# Altium schematic sheet Battery Manager.SchDoc: Battery Manager
size A4; CompanyName: St. Cloud State University; Organization: Senior Design Project; Address1: Prosthetic Hand; Address2: Matthew Varas; Address3: Rachel Mertz; Address4: Donnell Jones; DocumentNumber: 4; Revision: 1.1; SheetNumber: 4; SheetTotal: 6
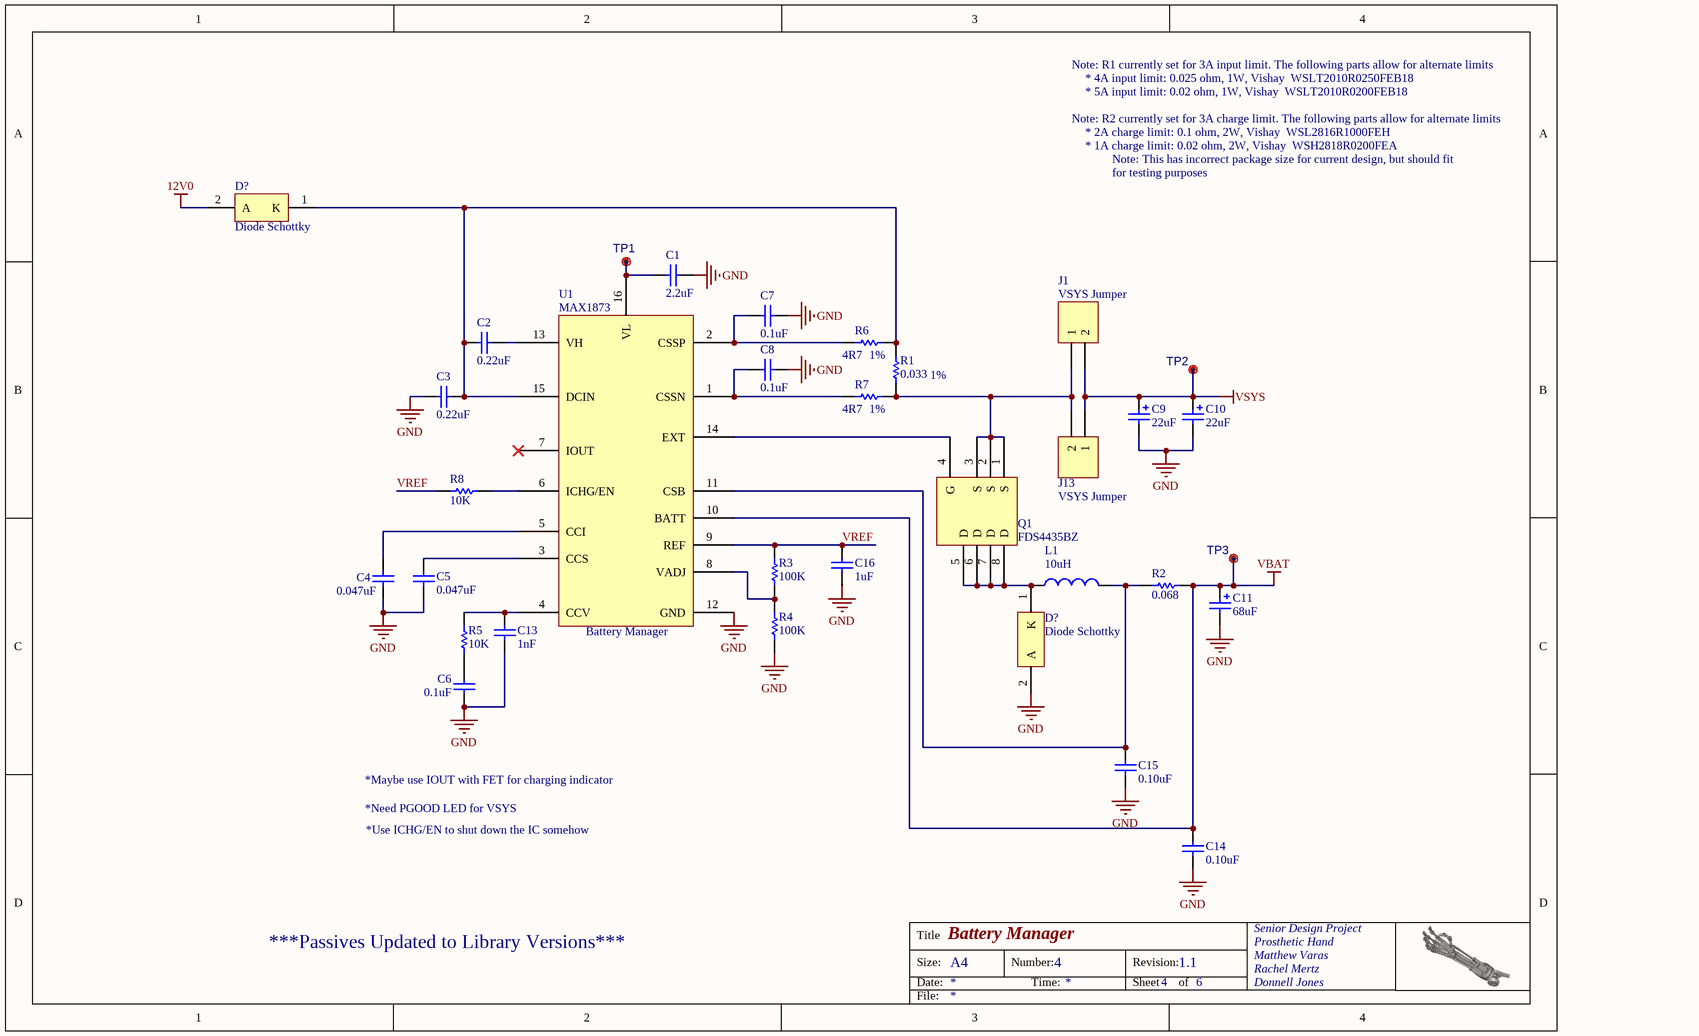
[diagram p0: Battery Manager.SchDoc]

## Parts
(Parts that share a designator on the sheet are numbered #1, #2 ... from top to bottom, then left to right.)
C1  value 2.2uF  [0805 Cap]  (hidden comment: Cap)
C2  value 0.22uF  [0805 Cap]  (hidden comment: Cap)
C3  value 0.22uF  [0805 Cap]  (hidden comment: Cap)
C4  value 0.047uF  [0805 Cap]  (hidden comment: Cap)
C5  value 0.047uF  [0805 Cap]  (hidden comment: Cap)
C6  value 0.1uF  [0805 Cap]  (hidden comment: Cap)
C7  value 0.1uF  Tolerance: 1%  [0805 Cap]  (hidden comment: Cap)
C8  value 0.1uF  [0805 Cap]  (hidden comment: Cap)
C9  22uF  [Cap Tant D]
C10  22uF  [Cap Tant D]
C11  68uF  [Cap Tant E]
C13  value 1nF  [0603 Cap]  (hidden comment: Cap)
C14  value 0.10uF  [0805 Cap]  (hidden comment: Cap)
C15  value 0.10uF  [0805 Cap]  (hidden comment: Cap)
C16  value 1uF  [0805 Cap]  (hidden comment: Cap)
D?#1  Diode Schottky  [ONSC-SMC-2-403-03_V]
D?#2  Diode Schottky  [ONSC-SMC-2-403-03_V]
J1  VSYS Jumper  [HDR1X2]
J13  VSYS Jumper  [HDR1X2]
L1  10uH  [SRR1260 Ind]
Q1  FDS4435BZ  [SOIC-8]
R1  value 0.033  Tolerance: 1%  [2010 Resistor]  (hidden comment: Resistor)
R2  0.068  [WSL2816]
R3  value 100K  [0805 Resistor]  (hidden comment: Resistor)
R4  value 100K  [0805 Resistor]  (hidden comment: Resistor)
R5  value 10K  [0805 Resistor]  (hidden comment: Resistor)
R6  value 4R7  [0603 Resistor]  (hidden comment: Resistor)
R7  value 4R7  Tolerance: 1%  [0603 Resistor]  (hidden comment: Resistor)
R8  value 10K  [0805 Resistor]  (hidden comment: Resistor)
TP1  Test Point  [Testpoint_70]  (value not drawn)
TP2  Test Point  [Testpoint_70]  (value not drawn)
TP3  Test Point  [Testpoint_70]  (value not drawn)
U1  MAX1873  Desc: Battery Manager  [QSOP-16]

## Nets
12V0: D?#1.2(A)
GND: C1.1 C3.2 C4.1 C5.1 C6.2 C7.1 C8.1 C9.2 C10.2 C11.2 C13.1 C14.1 C15.1 C16.1 D?#2.2(A) R4.1 U1.12(GND)
VBAT: C11.1 C14.2 R2.1 TP3.1(M80) U1.10(BATT)
VSYS: C9.1 C10.1 J1.2 J13.1 TP2.1(M80)
VREF: C16.2 R3.2 R8.1 U1.9(REF)
NetC1_2: C1.2 TP1.1(M80) U1.16(VL)
NetC2_1: C2.1 U1.13(VH)
NetC2_2: C2.2 C3.1 D?#1.1(K) R1.2 R6.2 U1.15(DCIN)
NetC4_2: C4.2 U1.5(CCI)
NetC5_2: C5.2 U1.3(CCS)
NetC6_1: C6.1 R5.1
NetC7_2: C7.2 R6.1 U1.2(CSSP)
NetC8_2: C8.2 R7.1 U1.1(CSSN)
NetC13_2: C13.2 R5.2 U1.4(CCV)
NetC15_2: C15.2 L1.2 R2.2 U1.11(CSB)
NetD?#2_1: D?#2.1(K) L1.1 Q1.5(D) Q1.6(D) Q1.7(D) Q1.8(D)
NetJ1_1: J1.1 J13.2 Q1.1(S) Q1.2(S) Q1.3(S) R1.1 R7.2
NetQ1_4: Q1.4(G) U1.14(EXT)
NetR3_1: R3.1 R4.2 U1.8(VADJ)
NetR8_2: R8.2 U1.6(ICHG/EN)

Not connected (* = marked no-connect by the designer): U1 7(IOUT)*

## Notes on the sheet
- Note: R1 currently set for 3A input limit. The following parts allow for alternate limits
- * 4A input limit: 0.025 ohm, 1W, Vishay  WSLT2010R0250FEB18
- * 5A input limit: 0.02 ohm, 1W, Vishay  WSLT2010R0200FEB18
- Note: R2 currently set for 3A charge limit. The following parts allow for alternate limits
- * 2A charge limit: 0.1 ohm, 2W, Vishay  WSL2816R1000FEH
- * 1A charge limit: 0.02 ohm, 2W, Vishay  WSH2818R0200FEA
- Note: This has incorrect package size for current design, but should fit
- for testing purposes
- *Maybe use IOUT with FET for charging indicator
- *Need PGOOD LED for VSYS
- *Use ICHG/EN to shut down the IC somehow
- ***Passives Updated to Library Versions***
- Title
- Size:
- Date:
- A4
- Number:
- Time:
- Revision:
- Sheet
- of
- File:

## Library data of the parts
C1 = Cap 0805: 2.2µF ±10% 50V X5R Ceramic Capacitor 0805; DIGI_PN01: 445-14407-1-ND; MFG_PN01: C2012X5R1H225K085AB; MFG_NAME01: TDK Corporation; Footprint: 0805
C2 C3 = Cap 0805: 0.22µF ±10% 35V X5R Ceramic Capacitor 0805; DIGI_PN01: 587-3366-1-ND; MFG_PN01: GMK212BJ224KGHT; MFG_NAME01: Taiyo Yuden; Footprint: 0805
C4 C5 = Cap 0805: 0.047µF ±10% 50V X7R Ceramic Capacitor 0805; DIGI_PN01: 490-8050-1-ND; MFG_PN01: GCM21BR71H473KA37L; MFG_NAME01: Murata; Footprint: 0805
C6-C8 C14 C15 = Cap 0805: 0.10µF ±10% 50V X7R Ceramic Capacitor 0805; DIGI_PN01: 445-6045-1-ND; MFG_PN01: C2012X7R1H104K125AM; MFG_NAME01: TDK Corporation; Footprint: 0805
C9 C10 = Cap Pol2: CAP TANT 22UF 35V 10% 2917; DIGI_PN01: 478-3356-1-ND; MFG_NAME01: AVX; MFG_PN01: TPSD226K035R0200; Case-EIA: 2917; Value: 22uF
C11 = Cap Pol2: CAP TANT 68UF 25V 20% 2917; DIGI_PN01: 478-4152-1-ND; MFG_NAME01: AVX; MFG_PN01: TPSE686M025R0125; Case-EIA: 2917; Value: 68uF
C13 = Cap 0603: 1000pF ±10% 50V X7R Ceramic Capacitor 0603; DIGI_PN01: 490-1494-1-ND; MFG_PN01: GRM188R71H102KA01D; MFG_NAME01: Murata; Footprint: 0603
C16 = Cap 0805: 1µF ±10% 25V X7R Ceramic Capacitor 0805; DIGI_PN01: 445-1354-1-ND; MFG_PN01: C2012X7R1E105K125AB; MFG_NAME01: TDK Corporation; Footprint: 0805
D?#1 D?#2 = Diode MBRS340T3G: DIODE SCHOTTKY 40V 4A SMC; MFG_NAME01: ON Semiconductor; DIGI_PN01: MBRS340T3GOSCT-ND; MFG_PN01: MBRS340T3G
J1 J13 = Header 2: PEC02SAAN; MFG_NAME01: Sullins Connector Solutions; DIGI_PN01: S1012E-02-ND; MFG_PN01: PEC02SAAN
L1 = SRR1260A-100MCT-ND: FIXED IND 10UH 5.5A 20 MOHM SMD; MFG_NAME01: Bourns; Current Rating: 5.5A; MFG_PN01: SRR1260A-100M; DIGI_PN01: SRR1260A-100MCT-ND; Value: 10uH
Q1 = FDS4435BZ: MOSFET P-CH 30V 8.8A 8-SOIC; MFG_NAME01: Fairchild Semiconductor; DIGI_PN01: FDS4435BZCT-ND; MFG_PN01: FDS4435BZ; Case-EIA: 8-SOIC
R1 = Resistor 2010: RES SMD 0.033 OHM 1% 1W 2010; MFG_PN01: WSL2010R0330FEA18; MFG_NAME01: Vishay Dale; DIGI_PN01: WSLF-.033CT-ND; Footprint: 2010
R2 = CMP-1017-00002-1: RES SMD 0.068 OHM 1% 2W 2816; Case-Metric: 5025; Case-EIA: 2816; MFG_PN01: WSL2816R0680FEH; DIGI_PN01: WSLK-.068CT-ND; MFG_NAME01: Vishay Dale; Tolerance: 1%; Technology: SMT; Power: 2W; Value: 0.068
R3 R4 = Resistor 0805: RES SMD 100K OHM 1% 1/8W 0805; MFG_PN01: RC0805FR-07100KL; MFG_NAME01: Yageo; DIGI_PN01: 311-100KCRCT-ND; Footprint: 0805
R5 R8 = Resistor 0805: RES SMD 10K OHM 1% 1/8W 0805; MFG_PN01: RC0805FR-0710KL; MFG_NAME01: Yageo; DIGI_PN01: 311-10.0KCRCT-ND; Footprint: 0805
R6 R7 = Resistor 0603: RES SMD 4.7 OHM 1% 1/10W 0603; MFG_PN01: RC1608F4R7CS; MFG_NAME01: Samsung; DIGI_PN01: 1276-4486-1-ND; Footprint: 0603
TP1-TP3 = Test Point: Test Pad; MFG_PN01: DNP; MFG_NAME01: DNP; DNP: DNP
U1 = MAX1873: IC CNTRLR CHARGE LI+ 16-QSOP; MFG_PN01: MAX1873REEE+T; MFG_NAME01: Maxim Integrated; DIGI_PN01: MAX1873REEE+TCT-ND; Case-EIA: 16-SSOP